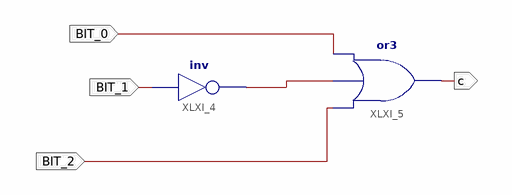
[diagram p0: schematic sheet 1]
// Xilinx ISE schematic SEG_C.sch (spartan6) as structural Verilog: 2 symbols, 4 ports
module SEG_C (
  input  BIT_0,
  input  BIT_2,
  input  BIT_1,
  output c
);

  wire XLXN_11;

  not XLXI_4 (XLXN_11, BIT_1);
  or XLXI_5 (c, BIT_2, XLXN_11, BIT_0);
endmodule
